# Altium project LimeSDR-USB_1v4s.PrjPcb (part 7 of 7)
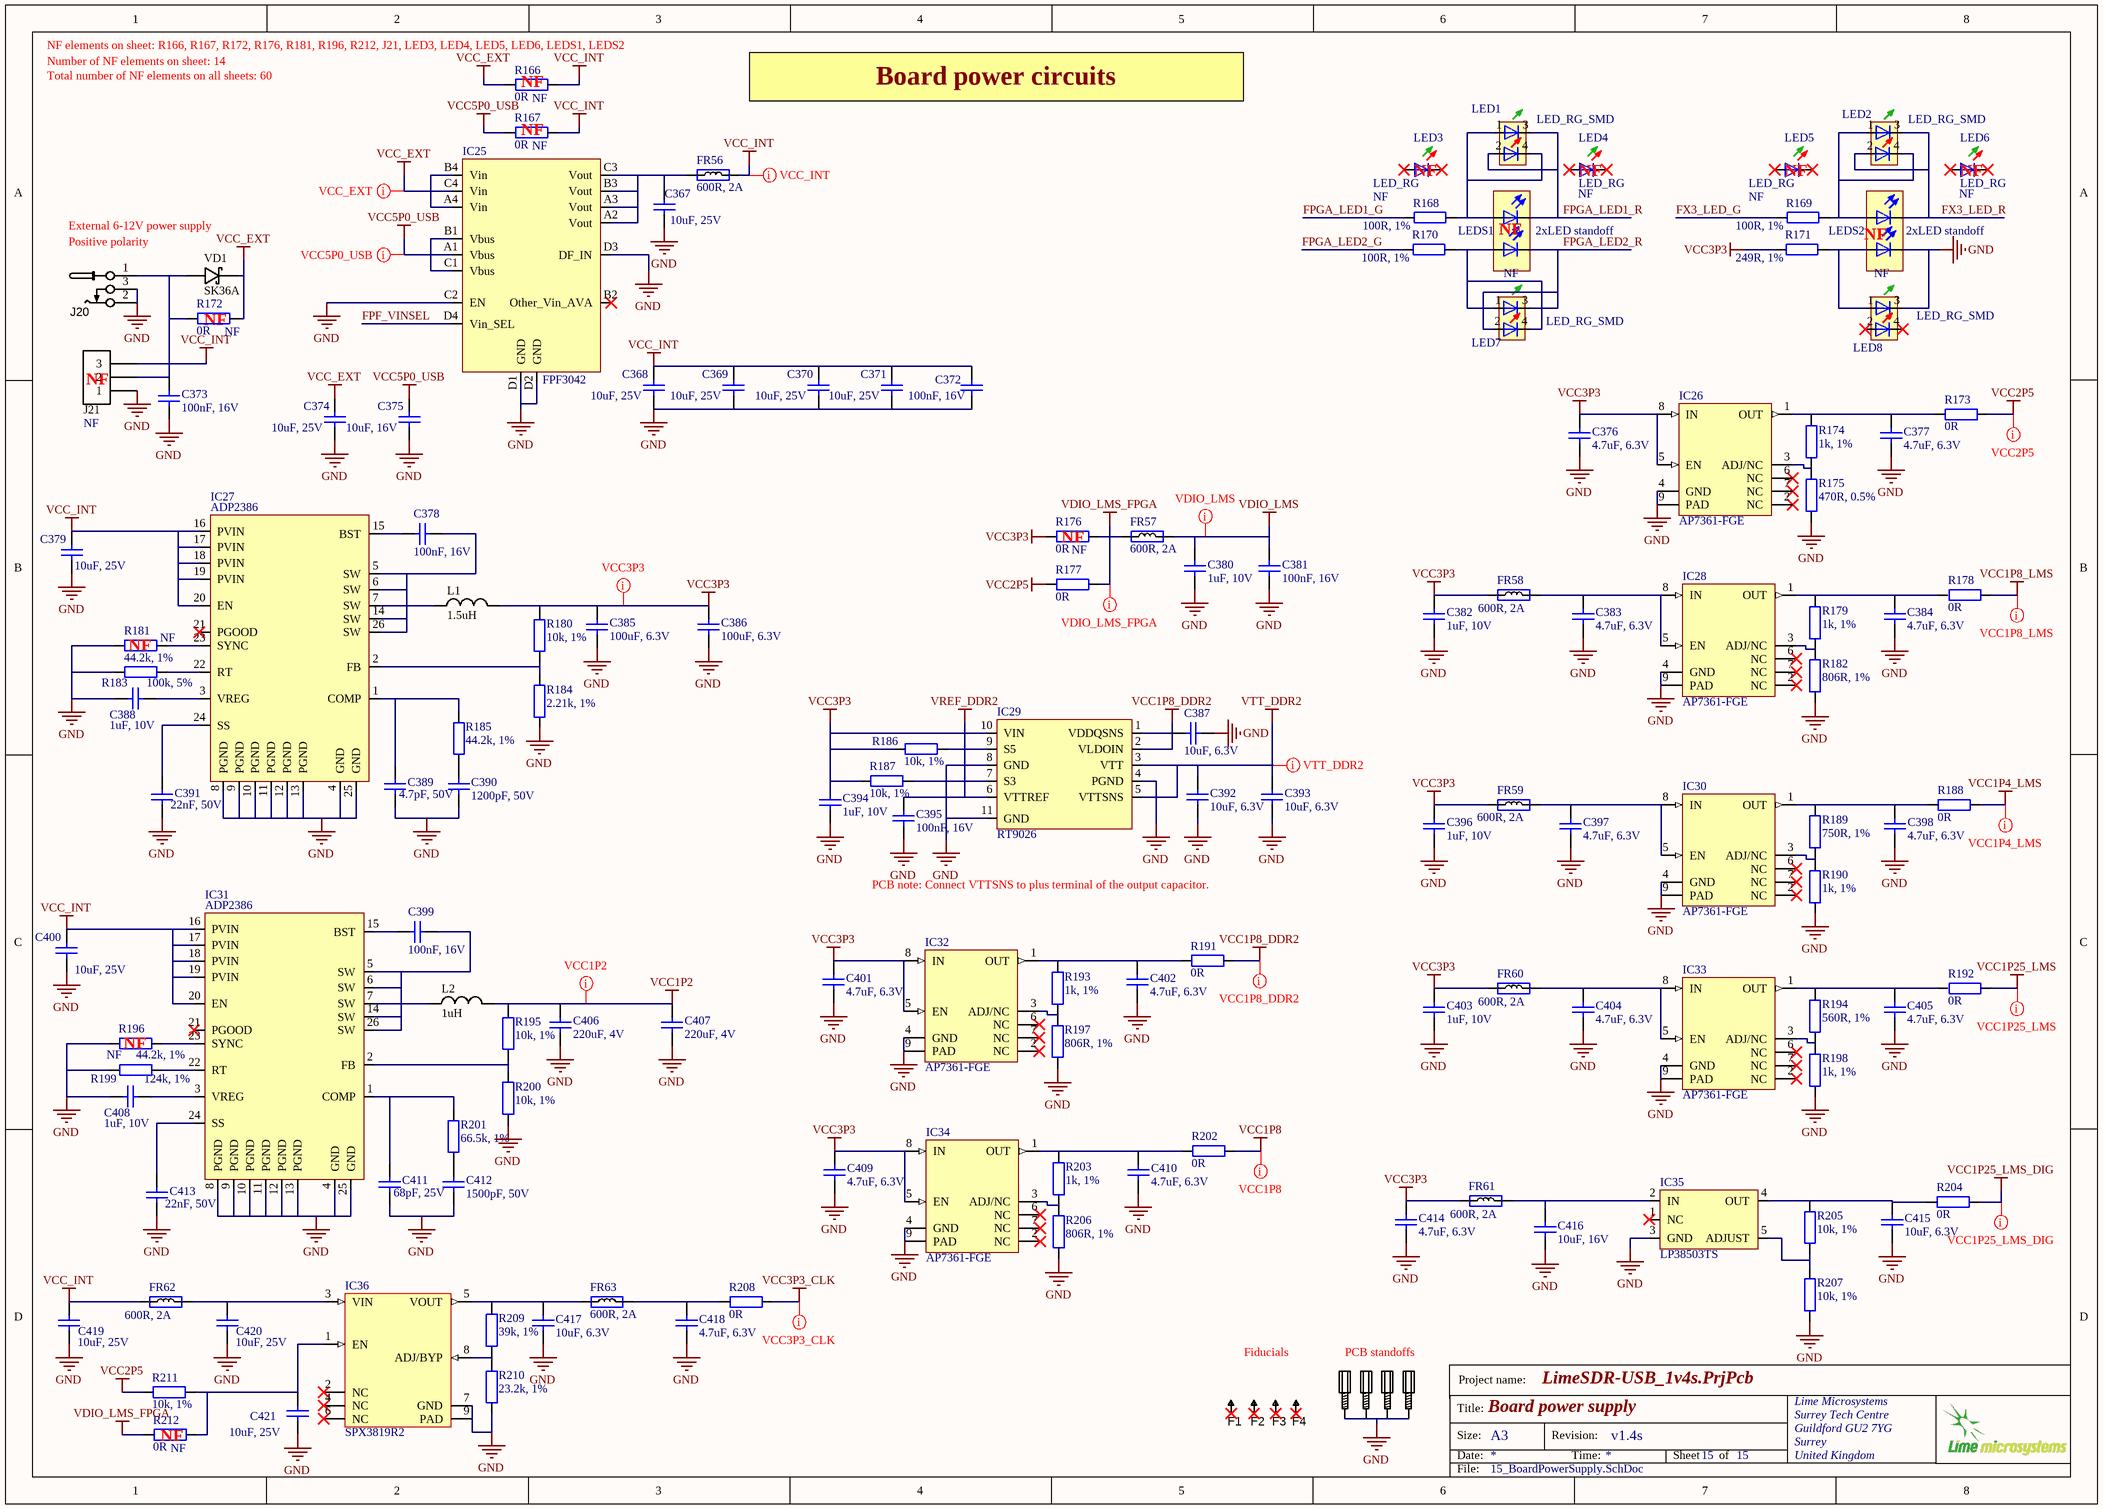
[diagram p15: 15_BoardPowerSupply.SchDoc]

## Nets that join several sheets
GND: 04_LMS7002M_Misc (13 pins), 05_LMS7002M_RF1 (32 pins), 06_LMS7002M_RF2 (32 pins), 07_LMS7002M_Power (84 pins), 08_FPGA_banks_1_2_3_4 (17 pins), 09_FPGA_banks_5_6_7_8 (23 pins), 10_FPGA_misc (196 pins), 11_DDR2 (103 pins), 12_USB3_0_device (45 pins), 13_USB3_0_power (54 pins), 14_Clocks (70 pins), 15_BoardPowerSupply (114 pins)
VCC1P2: 10_FPGA_misc (62 pins), 13_USB3_0_power (FR44.2 FR45.2 FR46.2 FR48.1), 15_BoardPowerSupply (C406.2 C407.2 L2.2 R195.1)
VCC1P4_LMS: 07_LMS7002M_Power (6 pins), 15_BoardPowerSupply (R188.1)
VCC1P8: 08_FPGA_banks_1_2_3_4 (R46.2), 10_FPGA_misc (42 pins), 12_USB3_0_device (R131.2), 13_USB3_0_power (FR40.1), 14_Clocks (7 pins), 15_BoardPowerSupply (R202.1)
VCC1P8_DDR2: 11_DDR2 (73 pins), 15_BoardPowerSupply (C387.2 IC29.1 IC29.2 R191.1)
VCC1P8_FX3: 12_USB3_0_device (R115.1 R116.1 R119.1), 13_USB3_0_power (12 pins)
VCC1P8_LMS: 05_LMS7002M_RF1 (9 pins), 06_LMS7002M_RF2 (9 pins), 07_LMS7002M_Power (11 pins), 15_BoardPowerSupply (R178.1)
VCC1P25_LMS: 07_LMS7002M_Power (22 pins), 15_BoardPowerSupply (R192.1)
VCC1P25_LMS_DIG: 07_LMS7002M_Power (R22.2 R24.2 R26.2 R28.2), 15_BoardPowerSupply (R204.1)
VCC2P5: 10_FPGA_misc (FR37.1), 13_USB3_0_power (FR47.2), 15_BoardPowerSupply (R173.1 R177.2 R211.1)
VCC3P3: 10_FPGA_misc (25 pins), 12_USB3_0_device (24 pins), 13_USB3_0_power (FR41.1 FR43.2), 15_BoardPowerSupply (27 pins)
VCC3P3_CLK: 13_USB3_0_power (FR42.2), 14_Clocks (16 pins), 15_BoardPowerSupply (R208.1)
VCC3P3_FX3: 12_USB3_0_device (IC13.E10), 13_USB3_0_power (8 pins)
VCC5P0_USB: 12_USB3_0_device (C272.1 FR38.1 J15.1), 15_BoardPowerSupply (5 pins)
VCC_CFX3: 12_USB3_0_device (R118.2), 13_USB3_0_power (7 pins)
VCC_INT: 10_FPGA_misc (R63.1), 15_BoardPowerSupply (23 pins)
VDIO_LMS: 04_LMS7002M_Misc (14 pins), 07_LMS7002M_Power (5 pins), 15_BoardPowerSupply (C380.2 C381.1 FR57.2)
VDIO_LMS_FPGA: 09_FPGA_banks_5_6_7_8 (R49.2), 10_FPGA_misc (33 pins), 12_USB3_0_device (R103.1), 14_Clocks (FR50.1 R149.2), 15_BoardPowerSupply (FR57.1 R176.1 R177.1 R212.2)
VREF_DDR2: 08_FPGA_banks_1_2_3_4 (24 pins), 11_DDR2 (C244.1 C269.1 IC11.J2 IC12.J2), 15_BoardPowerSupply (C395.1 IC29.6)
VTT_DDR2: 11_DDR2 (72 pins), 15_BoardPowerSupply (C392.2 C393.2 IC29.3 IC29.5)
ADF_MUXOUT: 08_FPGA_banks_1_2_3_4 (IC8.J2), 14_Clocks (IC23.15 R160.1)
BRDG_INT: 08_FPGA_banks_1_2_3_4 (IC8.R1), 12_USB3_0_device (IC13.F2 IC19.9 R131.1)
BRDG_SPI_FPGA_SS: 08_FPGA_banks_1_2_3_4 (IC8.K7), 12_USB3_0_device (IC19.1)
BRDG_SPI_MISO: 08_FPGA_banks_1_2_3_4 (IC8.C1), 12_USB3_0_device (IC19.5)
BRDG_SPI_MOSI: 08_FPGA_banks_1_2_3_4 (IC8.B1), 12_USB3_0_device (IC19.6)
BRDG_SPI_SCLK: 08_FPGA_banks_1_2_3_4 (IC8.B2), 12_USB3_0_device (IC19.11)
DDR2_1_A0: 08_FPGA_banks_1_2_3_4 (IC8.W1), 11_DDR2 (IC11.M8 R77.5)
DDR2_1_A1: 08_FPGA_banks_1_2_3_4 (IC8.AA3), 11_DDR2 (IC11.M3 R75.7)
DDR2_1_A2: 08_FPGA_banks_1_2_3_4 (IC8.Y3), 11_DDR2 (IC11.M7 R77.4)
DDR2_1_A3: 08_FPGA_banks_1_2_3_4 (IC8.V6), 11_DDR2 (IC11.N2 R75.4)
DDR2_1_A4: 08_FPGA_banks_1_2_3_4 (IC8.AA1), 11_DDR2 (IC11.N8 R77.3)
DDR2_1_A5: 08_FPGA_banks_1_2_3_4 (IC8.AB3), 11_DDR2 (IC11.N3 R75.5)
DDR2_1_A6: 08_FPGA_banks_1_2_3_4 (IC8.Y2), 11_DDR2 (IC11.N7 R77.2)
DDR2_1_A7: 08_FPGA_banks_1_2_3_4 (IC8.AB5), 11_DDR2 (IC11.P2 R75.1)
DDR2_1_A8: 08_FPGA_banks_1_2_3_4 (IC8.Y1), 11_DDR2 (IC11.P8 R77.1)
DDR2_1_A9: 08_FPGA_banks_1_2_3_4 (IC8.V7), 11_DDR2 (IC11.P3 R75.3)
DDR2_1_A10: 08_FPGA_banks_1_2_3_4 (IC8.Y6), 11_DDR2 (IC11.M2 R75.6)
DDR2_1_A11: 08_FPGA_banks_1_2_3_4 (IC8.W2), 11_DDR2 (IC11.P7 R75.8)
DDR2_1_A12: 08_FPGA_banks_1_2_3_4 (IC8.T8), 11_DDR2 (IC11.R2 R75.2)
DDR2_1_BA0: 08_FPGA_banks_1_2_3_4 (IC8.V4), 11_DDR2 (IC11.L2 R78.2)
DDR2_1_BA1: 08_FPGA_banks_1_2_3_4 (IC8.V3), 11_DDR2 (IC11.L3 R78.3)
DDR2_1_BA2: 08_FPGA_banks_1_2_3_4 (IC8.V1), 11_DDR2 (IC11.L1 R78.4)
DDR2_1_CASn: 08_FPGA_banks_1_2_3_4 (IC8.T4), 11_DDR2 (IC11.L7 R78.1)
DDR2_1_CKE: 08_FPGA_banks_1_2_3_4 (IC8.R7), 11_DDR2 (IC11.K2 R78.6)
DDR2_1_CLK_N: 08_FPGA_banks_1_2_3_4 (IC8.U8), 11_DDR2 (IC11.K8 R76.2)
DDR2_1_CLK_P: 08_FPGA_banks_1_2_3_4 (IC8.U7), 11_DDR2 (IC11.J8 R76.1)
DDR2_1_CSn: 08_FPGA_banks_1_2_3_4 (IC8.R6), 11_DDR2 (IC11.L8 R77.6)
DDR2_1_DM0: 08_FPGA_banks_1_2_3_4 (IC8.AA7), 11_DDR2 (IC11.F3)
DDR2_1_DM1: 08_FPGA_banks_1_2_3_4 (IC8.V5), 11_DDR2 (IC11.B3)
DDR2_1_DQ0: 08_FPGA_banks_1_2_3_4 (IC8.U10), 11_DDR2 (IC11.G8)
DDR2_1_DQ1: 08_FPGA_banks_1_2_3_4 (IC8.AB8), 11_DDR2 (IC11.G2)
DDR2_1_DQ2: 08_FPGA_banks_1_2_3_4 (IC8.AB7), 11_DDR2 (IC11.H7)
DDR2_1_DQ3: 08_FPGA_banks_1_2_3_4 (IC8.AA9), 11_DDR2 (IC11.H3)
DDR2_1_DQ4: 08_FPGA_banks_1_2_3_4 (IC8.V11), 11_DDR2 (IC11.H1)
DDR2_1_DQ5: 08_FPGA_banks_1_2_3_4 (IC8.W10), 11_DDR2 (IC11.H9)
DDR2_1_DQ6: 08_FPGA_banks_1_2_3_4 (IC8.AA8), 11_DDR2 (IC11.F1)
DDR2_1_DQ7: 08_FPGA_banks_1_2_3_4 (IC8.Y10), 11_DDR2 (IC11.F9)
DDR2_1_DQ8: 08_FPGA_banks_1_2_3_4 (IC8.W6), 11_DDR2 (IC11.C8)
DDR2_1_DQ9: 08_FPGA_banks_1_2_3_4 (IC8.AA5), 11_DDR2 (IC11.C2)
DDR2_1_DQ10: 08_FPGA_banks_1_2_3_4 (IC8.W7), 11_DDR2 (IC11.D7)
DDR2_1_DQ11: 08_FPGA_banks_1_2_3_4 (IC8.V8), 11_DDR2 (IC11.D3)
DDR2_1_DQ12: 08_FPGA_banks_1_2_3_4 (IC8.W8), 11_DDR2 (IC11.D1)
DDR2_1_DQ13: 08_FPGA_banks_1_2_3_4 (IC8.Y7), 11_DDR2 (IC11.D9)
DDR2_1_DQ14: 08_FPGA_banks_1_2_3_4 (IC8.U9), 11_DDR2 (IC11.B1)
DDR2_1_DQ15: 08_FPGA_banks_1_2_3_4 (IC8.AA4), 11_DDR2 (IC11.B9)
DDR2_1_DQS0: 08_FPGA_banks_1_2_3_4 (IC8.AB9), 11_DDR2 (IC11.F7)
DDR2_1_DQS1: 08_FPGA_banks_1_2_3_4 (IC8.V10), 11_DDR2 (IC11.B7)
DDR2_1_ODT: 08_FPGA_banks_1_2_3_4 (IC8.P6), 11_DDR2 (IC11.K9 R77.8)
DDR2_1_RASn: 08_FPGA_banks_1_2_3_4 (IC8.T5), 11_DDR2 (IC11.K7 R77.7)
DDR2_1_WEn: 08_FPGA_banks_1_2_3_4 (IC8.T7), 11_DDR2 (IC11.K3 R78.5)
DDR2_2_A0: 08_FPGA_banks_1_2_3_4 (IC8.U15), 11_DDR2 (IC12.M8 R81.3)
DDR2_2_A1: 08_FPGA_banks_1_2_3_4 (IC8.AA17), 11_DDR2 (IC12.M3 R83.7)
DDR2_2_A2: 08_FPGA_banks_1_2_3_4 (IC8.T14), 11_DDR2 (IC12.M7 R81.1)
DDR2_2_A3: 08_FPGA_banks_1_2_3_4 (IC8.Y17), 11_DDR2 (IC12.N2 R83.2)
DDR2_2_A4: 08_FPGA_banks_1_2_3_4 (IC8.T16), 11_DDR2 (IC12.N8 R81.5)
DDR2_2_A5: 08_FPGA_banks_1_2_3_4 (IC8.P7), 11_DDR2 (IC12.N3 R83.6)
DDR2_2_A6: 08_FPGA_banks_1_2_3_4 (IC8.U17), 11_DDR2 (IC12.N7 R81.2)
DDR2_2_A7: 08_FPGA_banks_1_2_3_4 (IC8.N8), 11_DDR2 (IC12.P2 R83.3)
DDR2_2_A8: 08_FPGA_banks_1_2_3_4 (IC8.R16), 11_DDR2 (IC12.P8 R81.6)
DDR2_2_A9: 08_FPGA_banks_1_2_3_4 (IC8.AA20), 11_DDR2 (IC12.P3 R83.5)
DDR2_2_A10: 08_FPGA_banks_1_2_3_4 (IC8.AB17), 11_DDR2 (IC12.M2 R83.1)
DDR2_2_A11: 08_FPGA_banks_1_2_3_4 (IC8.U16), 11_DDR2 (IC12.P7 R81.4)
DDR2_2_A12: 08_FPGA_banks_1_2_3_4 (IC8.U14), 11_DDR2 (IC12.R2 R83.4)
DDR2_2_BA0: 08_FPGA_banks_1_2_3_4 (IC8.U13), 11_DDR2 (IC12.L2 R84.3)
DDR2_2_BA1: 08_FPGA_banks_1_2_3_4 (IC8.T13), 11_DDR2 (IC12.L3 R84.2)
DDR2_2_BA2: 08_FPGA_banks_1_2_3_4 (IC8.V2), 11_DDR2 (IC12.L1 R84.4)
DDR2_2_CASn: 08_FPGA_banks_1_2_3_4 (IC8.T10), 11_DDR2 (IC12.L7 R81.7)
DDR2_2_CKE: 08_FPGA_banks_1_2_3_4 (IC8.AB10), 11_DDR2 (IC12.K2 R84.6)
DDR2_2_CLK_N: 08_FPGA_banks_1_2_3_4 (IC8.R15), 11_DDR2 (IC12.K8 R82.2)
DDR2_2_CLK_P: 08_FPGA_banks_1_2_3_4 (IC8.R14), 11_DDR2 (IC12.J8 R82.1)
DDR2_2_CSn: 08_FPGA_banks_1_2_3_4 (IC8.Y8), 11_DDR2 (IC12.L8 R81.8)
DDR2_2_DM0: 08_FPGA_banks_1_2_3_4 (IC8.AA16), 11_DDR2 (IC12.F3)
DDR2_2_DM1: 08_FPGA_banks_1_2_3_4 (IC8.AA10), 11_DDR2 (IC12.B3)
DDR2_2_DQ0: 08_FPGA_banks_1_2_3_4 (IC8.W15), 11_DDR2 (IC12.G8)
DDR2_2_DQ1: 08_FPGA_banks_1_2_3_4 (IC8.V14), 11_DDR2 (IC12.G2)
DDR2_2_DQ2: 08_FPGA_banks_1_2_3_4 (IC8.AB20), 11_DDR2 (IC12.H7)
DDR2_2_DQ3: 08_FPGA_banks_1_2_3_4 (IC8.AB18), 11_DDR2 (IC12.H3)
DDR2_2_DQ4: 08_FPGA_banks_1_2_3_4 (IC8.T15), 11_DDR2 (IC12.H1)
DDR2_2_DQ5: 08_FPGA_banks_1_2_3_4 (IC8.W17), 11_DDR2 (IC12.H9)
DDR2_2_DQ6: 08_FPGA_banks_1_2_3_4 (IC8.AB16), 11_DDR2 (IC12.F1)
DDR2_2_DQ7: 08_FPGA_banks_1_2_3_4 (IC8.V15), 11_DDR2 (IC12.F9)
DDR2_2_DQ8: 08_FPGA_banks_1_2_3_4 (IC8.W13), 11_DDR2 (IC12.C8)
DDR2_2_DQ9: 08_FPGA_banks_1_2_3_4 (IC8.AB13), 11_DDR2 (IC12.C2)
DDR2_2_DQ10: 08_FPGA_banks_1_2_3_4 (IC8.AA15), 11_DDR2 (IC12.D7)
DDR2_2_DQ11: 08_FPGA_banks_1_2_3_4 (IC8.AB14), 11_DDR2 (IC12.D3)
DDR2_2_DQ12: 08_FPGA_banks_1_2_3_4 (IC8.AA14), 11_DDR2 (IC12.D1)
DDR2_2_DQ13: 08_FPGA_banks_1_2_3_4 (IC8.AB15), 11_DDR2 (IC12.D9)
DDR2_2_DQ14: 08_FPGA_banks_1_2_3_4 (IC8.AA13), 11_DDR2 (IC12.B1)
DDR2_2_DQ15: 08_FPGA_banks_1_2_3_4 (IC8.U12), 11_DDR2 (IC12.B9)
DDR2_2_DQS0: 08_FPGA_banks_1_2_3_4 (IC8.V13), 11_DDR2 (IC12.F7)
DDR2_2_DQS1: 08_FPGA_banks_1_2_3_4 (IC8.Y13), 11_DDR2 (IC12.B7)
DDR2_2_ODT: 08_FPGA_banks_1_2_3_4 (IC8.T12), 11_DDR2 (IC12.K9 R84.5)
DDR2_2_RASn: 08_FPGA_banks_1_2_3_4 (IC8.T11), 11_DDR2 (IC12.K7 R83.8)
DDR2_2_WEn: 08_FPGA_banks_1_2_3_4 (IC8.T9), 11_DDR2 (IC12.K3 R84.8)
EXP_AS_SS: 10_FPGA_misc (R74.1), 12_USB3_0_device (IC17.2)
EXP_AS_SW: 10_FPGA_misc (R64.2), 12_USB3_0_device (IC17.10)
FAN_CTRL: 08_FPGA_banks_1_2_3_4 (IC8.E4), 10_FPGA_misc (R65.2 R67.1 VT7.G)
FPF_VINSEL: 09_FPGA_banks_5_6_7_8 (R48.1), 15_BoardPowerSupply (IC25.D4)
FPGA_AS_ASDO: 08_FPGA_banks_1_2_3_4 (IC8.D1), 10_FPGA_misc (IC9.3)
FPGA_AS_DATA0: 08_FPGA_banks_1_2_3_4 (IC8.K1), 10_FPGA_misc (R68.2)
FPGA_AS_NCSO: 08_FPGA_banks_1_2_3_4 (IC8.E2), 10_FPGA_misc (IC9.13)
FPGA_CLK_OUT: 08_FPGA_banks_1_2_3_4 (IC8.C2), 14_Clocks (R146.1)
FPGA_CONF_DONE: 10_FPGA_misc (IC8.M18), 12_USB3_0_device (R103.2 R108.2)
FPGA_GPIO0: 08_FPGA_banks_1_2_3_4 (IC8.H8), 10_FPGA_misc (J12.1)
FPGA_GPIO1: 08_FPGA_banks_1_2_3_4 (IC8.H6), 10_FPGA_misc (J12.2)
FPGA_GPIO2: 08_FPGA_banks_1_2_3_4 (IC8.H2), 10_FPGA_misc (J12.3)
FPGA_GPIO3: 08_FPGA_banks_1_2_3_4 (IC8.H1), 10_FPGA_misc (J12.4)
FPGA_GPIO4: 08_FPGA_banks_1_2_3_4 (IC8.G4), 10_FPGA_misc (J12.5)
FPGA_GPIO5: 08_FPGA_banks_1_2_3_4 (IC8.G3), 10_FPGA_misc (J12.6)
FPGA_GPIO6: 08_FPGA_banks_1_2_3_4 (IC8.F2), 10_FPGA_misc (J12.7)
FPGA_GPIO7: 08_FPGA_banks_1_2_3_4 (IC8.F1), 10_FPGA_misc (J12.8)
FPGA_I2C_SCL: 08_FPGA_banks_1_2_3_4 (IC8.H7), 12_USB3_0_device (R112.2)
FPGA_I2C_SDA: 08_FPGA_banks_1_2_3_4 (IC8.J7), 12_USB3_0_device (R110.2)
FPGA_LED1_G: 08_FPGA_banks_1_2_3_4 (IC8.D2), 15_BoardPowerSupply (R168.1)
FPGA_LED1_R: 08_FPGA_banks_1_2_3_4 (IC8.E3), 15_BoardPowerSupply (LED1.2 LED1.3 LEDS1.K1)
FPGA_LED2_G: 08_FPGA_banks_1_2_3_4 (IC8.J4), 15_BoardPowerSupply (R170.1)
FPGA_LED2_R: 08_FPGA_banks_1_2_3_4 (IC8.E1), 15_BoardPowerSupply (LED7.2 LED7.3 LEDS1.K2)
FPGA_NCONFIG: 10_FPGA_misc (IC8.K5), 12_USB3_0_device (R105.2 R106.2)
FPGA_NSTATUS: 10_FPGA_misc (IC8.K6), 12_USB3_0_device (R104.2 R107.2)
FPGA_SPI0_LMS_SS: 04_LMS7002M_Misc (R9.2), 09_FPGA_banks_5_6_7_8 (IC8.D10)
FPGA_SPI0_MISO: 04_LMS7002M_Misc (R8.2), 09_FPGA_banks_5_6_7_8 (IC8.C8)
FPGA_SPI0_MOSI: 04_LMS7002M_Misc (R7.2), 09_FPGA_banks_5_6_7_8 (IC8.D7)
FPGA_SPI0_SCLK: 04_LMS7002M_Misc (R6.2), 09_FPGA_banks_5_6_7_8 (IC8.E6)
FPGA_SPI1_ADF_SS: 08_FPGA_banks_1_2_3_4 (IC8.J5), 14_Clocks (R165.1)
FPGA_SPI1_DAC_SS: 08_FPGA_banks_1_2_3_4 (IC8.J3), 14_Clocks (IC22.1)
FPGA_SPI1_MOSI: 08_FPGA_banks_1_2_3_4 (IC8.L8), 14_Clocks (IC22.3 R164.1)
FPGA_SPI1_SCLK: 08_FPGA_banks_1_2_3_4 (IC8.K8), 14_Clocks (IC22.2 R163.1)
FPGA_UART_RX: 08_FPGA_banks_1_2_3_4 (IC8.J1), 12_USB3_0_device (R109.2 R111.2)
FPGA_UART_TX: 08_FPGA_banks_1_2_3_4 (IC8.J8), 12_USB3_0_device (R113.2)
FX3_CTL0: 08_FPGA_banks_1_2_3_4 (IC8.L6), 12_USB3_0_device (R99.2)
FX3_CTL1: 08_FPGA_banks_1_2_3_4 (IC8.L7), 12_USB3_0_device (R100.2)
FX3_CTL2: 08_FPGA_banks_1_2_3_4 (IC8.M1), 12_USB3_0_device (R100.4)
FX3_CTL3: 08_FPGA_banks_1_2_3_4 (IC8.M2), 12_USB3_0_device (R100.6)
FX3_CTL4: 08_FPGA_banks_1_2_3_4 (IC8.M3), 12_USB3_0_device (R100.8)
FX3_CTL5: 08_FPGA_banks_1_2_3_4 (IC8.M4), 12_USB3_0_device (R101.2)
FX3_CTL6: 08_FPGA_banks_1_2_3_4 (IC8.M6), 12_USB3_0_device (R101.4)
FX3_CTL7: 08_FPGA_banks_1_2_3_4 (IC8.M7), 12_USB3_0_device (R101.6)
FX3_CTL8: 08_FPGA_banks_1_2_3_4 (IC8.M8), 12_USB3_0_device (R101.8)
FX3_CTL9: 08_FPGA_banks_1_2_3_4 (IC8.N1), 12_USB3_0_device (R102.2)
FX3_CTL10: 08_FPGA_banks_1_2_3_4 (IC8.N2), 12_USB3_0_device (R102.4)
FX3_CTL11: 08_FPGA_banks_1_2_3_4 (IC8.N5), 12_USB3_0_device (R102.6)
FX3_CTL12: 08_FPGA_banks_1_2_3_4 (IC8.N6), 12_USB3_0_device (R102.8)
FX3_DCTL9: 08_FPGA_banks_1_2_3_4 (IC8.P2), 12_USB3_0_device (IC13.H6)
FX3_DCTL10: 08_FPGA_banks_1_2_3_4 (IC8.N7), 12_USB3_0_device (IC13.K5)
FX3_DQ0: 09_FPGA_banks_5_6_7_8 (IC8.M19), 12_USB3_0_device (R87.2)
FX3_DQ1: 09_FPGA_banks_5_6_7_8 (IC8.AA21), 12_USB3_0_device (R87.4)
FX3_DQ2: 09_FPGA_banks_5_6_7_8 (IC8.Y22), 12_USB3_0_device (R87.6)
FX3_DQ3: 09_FPGA_banks_5_6_7_8 (IC8.Y21), 12_USB3_0_device (R87.8)
FX3_DQ4: 09_FPGA_banks_5_6_7_8 (IC8.W22), 12_USB3_0_device (R89.2)
FX3_DQ5: 09_FPGA_banks_5_6_7_8 (IC8.W21), 12_USB3_0_device (R89.4)
FX3_DQ6: 09_FPGA_banks_5_6_7_8 (IC8.W20), 12_USB3_0_device (R89.6)
FX3_DQ7: 09_FPGA_banks_5_6_7_8 (IC8.V22), 12_USB3_0_device (R89.8)
FX3_DQ8: 09_FPGA_banks_5_6_7_8 (IC8.V21), 12_USB3_0_device (R91.2)
FX3_DQ9: 09_FPGA_banks_5_6_7_8 (IC8.U22), 12_USB3_0_device (R91.4)
FX3_DQ10: 09_FPGA_banks_5_6_7_8 (IC8.U21), 12_USB3_0_device (R91.6)
FX3_DQ11: 09_FPGA_banks_5_6_7_8 (IC8.U20), 12_USB3_0_device (R91.8)
FX3_DQ12: 09_FPGA_banks_5_6_7_8 (IC8.U19), 12_USB3_0_device (R96.2)
FX3_DQ13: 09_FPGA_banks_5_6_7_8 (IC8.M22), 12_USB3_0_device (R96.4)
FX3_DQ14: 09_FPGA_banks_5_6_7_8 (IC8.M21), 12_USB3_0_device (R96.6)
FX3_DQ15: 09_FPGA_banks_5_6_7_8 (IC8.R22), 12_USB3_0_device (R96.8)
FX3_DQ16: 09_FPGA_banks_5_6_7_8 (IC8.R21), 12_USB3_0_device (R88.1)
FX3_DQ17: 09_FPGA_banks_5_6_7_8 (IC8.R20), 12_USB3_0_device (R88.3)
FX3_DQ18: 09_FPGA_banks_5_6_7_8 (IC8.R19), 12_USB3_0_device (R88.5)
FX3_DQ19: 09_FPGA_banks_5_6_7_8 (IC8.R18), 12_USB3_0_device (R88.7)
FX3_DQ20: 09_FPGA_banks_5_6_7_8 (IC8.P22), 12_USB3_0_device (R90.1)
FX3_DQ21: 09_FPGA_banks_5_6_7_8 (IC8.P21), 12_USB3_0_device (R90.3)
FX3_DQ22: 09_FPGA_banks_5_6_7_8 (IC8.M20), 12_USB3_0_device (R90.5)
FX3_DQ23: 09_FPGA_banks_5_6_7_8 (IC8.P16), 12_USB3_0_device (R90.7)
FX3_DQ24: 09_FPGA_banks_5_6_7_8 (IC8.P15), 12_USB3_0_device (R94.1)
FX3_DQ25: 09_FPGA_banks_5_6_7_8 (IC8.N22), 12_USB3_0_device (R94.3)
FX3_DQ26: 09_FPGA_banks_5_6_7_8 (IC8.N21), 12_USB3_0_device (R94.5)
FX3_DQ27: 09_FPGA_banks_5_6_7_8 (IC8.N20), 12_USB3_0_device (R94.7)
FX3_DQ28: 09_FPGA_banks_5_6_7_8 (IC8.N19), 12_USB3_0_device (R97.1)
FX3_DQ29: 09_FPGA_banks_5_6_7_8 (IC8.N18), 12_USB3_0_device (R97.3)
FX3_DQ30: 09_FPGA_banks_5_6_7_8 (IC8.N17), 12_USB3_0_device (R97.5)
FX3_DQ31: 09_FPGA_banks_5_6_7_8 (IC8.N16), 12_USB3_0_device (R97.7)
FX3_I2C_SCL: 12_USB3_0_device (7 pins), 14_Clocks (IC24.4)
FX3_I2C_SDA: 12_USB3_0_device (7 pins), 14_Clocks (IC24.5)
FX3_LED_G: 08_FPGA_banks_1_2_3_4 (IC8.G5), 15_BoardPowerSupply (R169.1)
FX3_LED_R: 08_FPGA_banks_1_2_3_4 (IC8.H5), 15_BoardPowerSupply (LED2.2 LED2.3 LEDS2.K1)
FX3_PCLK: 10_FPGA_misc (IC8.T21), 12_USB3_0_device (R98.1)
FX3_SPI_AS_SS: 10_FPGA_misc (R72.1), 12_USB3_0_device (IC13.C4)
FX3_SPI_MISO: 10_FPGA_misc (IC9.5), 12_USB3_0_device (IC13.C2 IC15.2 R111.1)
FX3_SPI_MOSI: 10_FPGA_misc (IC9.2), 12_USB3_0_device (IC13.D5 IC15.5 R113.1)
FX3_SPI_SCLK: 10_FPGA_misc (IC9.11), 12_USB3_0_device (IC13.D4 IC15.6 R114.2)
LM75_OS: 08_FPGA_banks_1_2_3_4 (IC8.J6), 10_FPGA_misc (R65.1), 12_USB3_0_device (IC16.3 R133.1)
LMK_CLK: 10_FPGA_misc (IC8.B12), 14_Clocks (IC20.15)
LMS_CORE_LDO_EN: 04_LMS7002M_Misc (IC1.U33 R5.1), 09_FPGA_banks_5_6_7_8 (IC8.B18)
LMS_DIQ1_D0: 04_LMS7002M_Misc (IC1.AG31), 09_FPGA_banks_5_6_7_8 (IC8.B17)
LMS_DIQ1_D1: 04_LMS7002M_Misc (IC1.AF30), 09_FPGA_banks_5_6_7_8 (IC8.B16)
LMS_DIQ1_D2: 04_LMS7002M_Misc (IC1.AF34), 09_FPGA_banks_5_6_7_8 (IC8.B15)
LMS_DIQ1_D3: 04_LMS7002M_Misc (IC1.AE31), 09_FPGA_banks_5_6_7_8 (IC8.B14)
LMS_DIQ1_D4: 04_LMS7002M_Misc (IC1.AD30), 09_FPGA_banks_5_6_7_8 (IC8.B13)
LMS_DIQ1_D5: 04_LMS7002M_Misc (IC1.AC29), 09_FPGA_banks_5_6_7_8 (IC8.C13)
LMS_DIQ1_D6: 04_LMS7002M_Misc (IC1.AE33), 09_FPGA_banks_5_6_7_8 (IC8.A18)
LMS_DIQ1_D7: 04_LMS7002M_Misc (IC1.AD32), 09_FPGA_banks_5_6_7_8 (IC8.A17)
LMS_DIQ1_D8: 04_LMS7002M_Misc (IC1.AC31), 09_FPGA_banks_5_6_7_8 (IC8.A16)
LMS_DIQ1_D9: 04_LMS7002M_Misc (IC1.AC33), 09_FPGA_banks_5_6_7_8 (IC8.A15)
LMS_DIQ1_D10: 04_LMS7002M_Misc (IC1.AB30), 09_FPGA_banks_5_6_7_8 (IC8.A14)
LMS_DIQ1_D11: 04_LMS7002M_Misc (IC1.AB32), 09_FPGA_banks_5_6_7_8 (IC8.A13)
LMS_DIQ2_D0: 04_LMS7002M_Misc (IC1.H30), 09_FPGA_banks_5_6_7_8 (IC8.B7)
LMS_DIQ2_D1: 04_LMS7002M_Misc (IC1.J31), 09_FPGA_banks_5_6_7_8 (IC8.B6)
LMS_DIQ2_D2: 04_LMS7002M_Misc (IC1.K30), 09_FPGA_banks_5_6_7_8 (IC8.B4)
LMS_DIQ2_D3: 04_LMS7002M_Misc (IC1.K32), 09_FPGA_banks_5_6_7_8 (IC8.B3)
LMS_DIQ2_D4: 04_LMS7002M_Misc (IC1.L31), 09_FPGA_banks_5_6_7_8 (IC8.A10)
LMS_DIQ2_D5: 04_LMS7002M_Misc (IC1.K34), 09_FPGA_banks_5_6_7_8 (IC8.A9)
LMS_DIQ2_D6: 04_LMS7002M_Misc (IC1.M30), 09_FPGA_banks_5_6_7_8 (IC8.A8)
LMS_DIQ2_D7: 04_LMS7002M_Misc (IC1.M32), 09_FPGA_banks_5_6_7_8 (IC8.A7)
LMS_DIQ2_D8: 04_LMS7002M_Misc (IC1.N31), 09_FPGA_banks_5_6_7_8 (IC8.A6)
LMS_DIQ2_D9: 04_LMS7002M_Misc (IC1.N33), 09_FPGA_banks_5_6_7_8 (IC8.A5)
LMS_DIQ2_D10: 04_LMS7002M_Misc (IC1.P30), 09_FPGA_banks_5_6_7_8 (IC8.A4)
LMS_DIQ2_D11: 04_LMS7002M_Misc (IC1.P32), 09_FPGA_banks_5_6_7_8 (IC8.A3)
LMS_ENABLE_IQSEL1: 04_LMS7002M_Misc (IC1.Y32), 09_FPGA_banks_5_6_7_8 (IC8.C4)
LMS_ENABLE_IQSEL2: 04_LMS7002M_Misc (IC1.R33), 09_FPGA_banks_5_6_7_8 (IC8.C7)
LMS_FCLK1: 04_LMS7002M_Misc (IC1.AA33), 09_FPGA_banks_5_6_7_8 (IC8.B20)
LMS_FCLK2: 04_LMS7002M_Misc (IC1.R29), 09_FPGA_banks_5_6_7_8 (IC8.E5)
LMS_I2C_SCL: 04_LMS7002M_Misc (IC1.C27 IC2.6 IC3.6 R12.2), 09_FPGA_banks_5_6_7_8 (IC8.C17)
LMS_I2C_SDA: 04_LMS7002M_Misc (IC1.D26 IC2.5 IC3.5 R13.2), 09_FPGA_banks_5_6_7_8 (IC8.C21)
LMS_MCLK1: 04_LMS7002M_Misc (IC1.AB34), 10_FPGA_misc (IC8.G21)
LMS_MCLK2: 04_LMS7002M_Misc (IC1.P34), 10_FPGA_misc (IC8.B11)
LMS_RESET: 04_LMS7002M_Misc (IC1.E27 R2.1), 09_FPGA_banks_5_6_7_8 (IC8.C6)
LMS_RXEN: 04_LMS7002M_Misc (IC1.V34 R4.2), 09_FPGA_banks_5_6_7_8 (IC8.C3)
LMS_TXEN: 04_LMS7002M_Misc (IC1.U29 R3.2), 09_FPGA_banks_5_6_7_8 (IC8.B10)
LMS_TXNRX1: 04_LMS7002M_Misc (IC1.V32 R1.1), 09_FPGA_banks_5_6_7_8 (IC8.B9)
LMS_TXNRX2: 04_LMS7002M_Misc (IC1.U31 R10.2), 09_FPGA_banks_5_6_7_8 (IC8.B8)
RxPLL_CLK: 04_LMS7002M_Misc (IC1.AM24), 14_Clocks (C325.2 R142.1)
SI_CLK0: 10_FPGA_misc (IC8.T2), 14_Clocks (IC24.13)
SI_CLK1: 10_FPGA_misc (IC8.AA12), 14_Clocks (IC24.12)
SI_CLK2: 10_FPGA_misc (IC8.AB12), 14_Clocks (IC24.9)
SI_CLK3: 10_FPGA_misc (IC8.T22), 14_Clocks (IC24.8)
SI_CLK5: 10_FPGA_misc (IC8.G1), 14_Clocks (IC24.17)
SI_CLK6: 10_FPGA_misc (IC8.AA11), 14_Clocks (IC24.16)
SI_CLK7: 10_FPGA_misc (IC8.AB11), 14_Clocks (IC24.15)
TX1_2_LB_AT: 05_LMS7002M_RF1 (C15.1 R14.2), 09_FPGA_banks_5_6_7_8 (IC8.E16)
TX1_2_LB_H: 05_LMS7002M_RF1 (C11.2 C22.2 IC4.4 IC5.6), 09_FPGA_banks_5_6_7_8 (IC8.F15)
TX1_2_LB_L: 05_LMS7002M_RF1 (C12.2 C21.2 IC4.6 IC5.4), 09_FPGA_banks_5_6_7_8 (IC8.F14)
TX1_2_LB_SH: 05_LMS7002M_RF1 (C17.1 C18.1 R16.2 R17.1), 09_FPGA_banks_5_6_7_8 (IC8.G15)
TX2_2_LB_AT: 06_LMS7002M_RF2 (C35.1 R18.2), 09_FPGA_banks_5_6_7_8 (IC8.E15)
TX2_2_LB_H: 06_LMS7002M_RF2 (C31.2 C42.2 IC6.4 IC7.6), 09_FPGA_banks_5_6_7_8 (IC8.H11)
TX2_2_LB_L: 06_LMS7002M_RF2 (C32.2 C41.2 IC6.6 IC7.4), 09_FPGA_banks_5_6_7_8 (IC8.F11)
TX2_2_LB_SH: 06_LMS7002M_RF2 (C37.1 C38.1 R20.1 R21.2), 09_FPGA_banks_5_6_7_8 (IC8.F16)
TxPLL_CLK: 04_LMS7002M_Misc (IC1.E5), 14_Clocks (C324.2 R139.1)